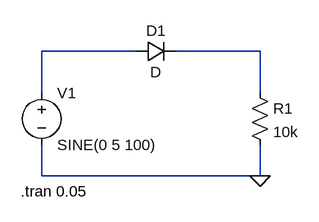
[diagram p0: schematic half_wave_rectifier.asc]
half_wave_rectifier.asc, the LTspice schematic file:
Version 4
SHEET 1 880 680
WIRE 128 48 -16 48
WIRE 320 48 192 48
WIRE -16 112 -16 48
WIRE 320 112 320 48
WIRE -16 240 -16 192
WIRE 320 240 320 192
WIRE 320 240 -16 240
FLAG 320 240 0
SYMBOL voltage -16 96 R0
WINDOW 123 0 0 Left 0
WINDOW 39 0 0 Left 0
SYMATTR InstName V1
SYMATTR Value SINE(0 5 100)
SYMBOL res 304 96 R0
SYMATTR InstName R1
SYMATTR Value 10k
SYMBOL diode 128 64 R270
WINDOW 0 32 32 VTop 2
WINDOW 3 0 32 VBottom 2
SYMATTR InstName D1
TEXT -48 264 Left 2 !.tran 0.05

The netlist it stands for:
* half_wave_rectifier.asc
V1 N001 0 SINE(0 5 100)
R1 N002 0 10k
D1 N001 N002 D
.model D D
.lib standard.dio
.tran 0.05
.backanno
.end